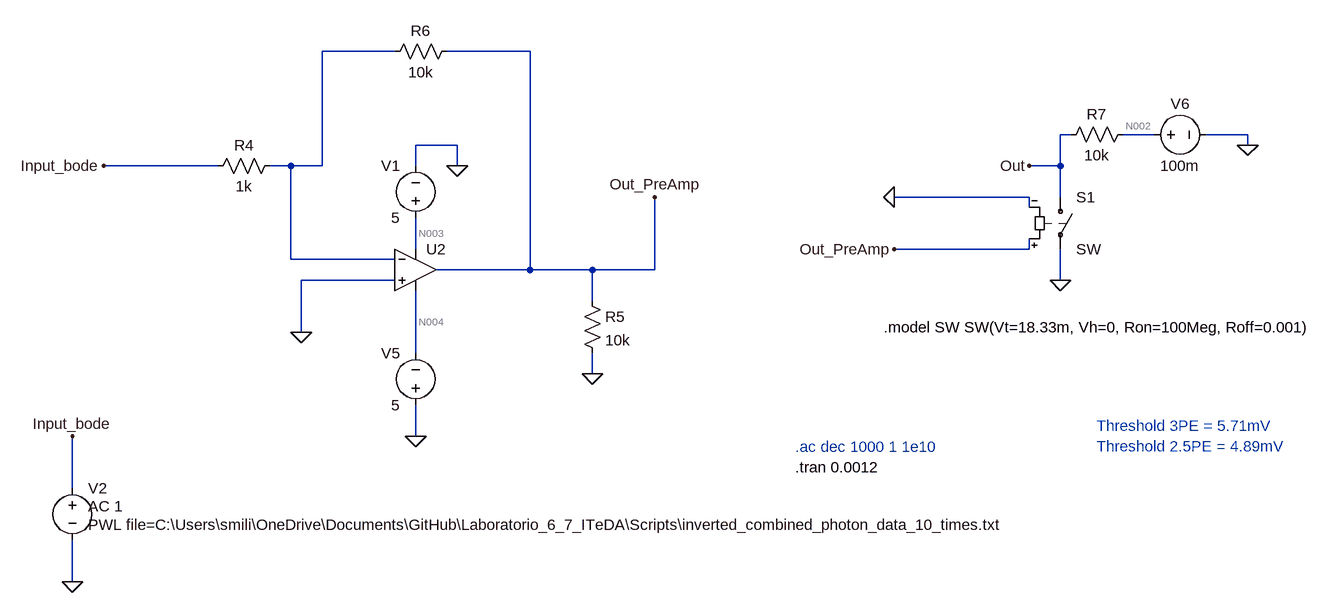
[diagram p0: schematic test_solo_preamp.asc]
test_solo_preamp.asc, the LTspice schematic file:
Version 4
SHEET 1 2516 1220
WIRE -768 -544 -880 -544
WIRE -560 -544 -688 -544
WIRE 272 -416 256 -416
WIRE 400 -416 352 -416
WIRE 544 -416 480 -416
WIRE -672 -400 -736 -400
WIRE 544 -400 544 -416
WIRE -1040 -368 -1216 -368
WIRE -928 -368 -960 -368
WIRE -880 -368 -880 -544
WIRE -880 -368 -928 -368
WIRE -736 -368 -736 -400
WIRE -672 -368 -672 -400
WIRE 256 -368 256 -416
WIRE 256 -368 208 -368
WIRE 208 -320 0 -320
WIRE 256 -320 256 -368
WIRE 208 -304 208 -320
WIRE -736 -240 -736 -288
WIRE 208 -240 208 -256
WIRE 208 -240 0 -240
WIRE -928 -224 -928 -368
WIRE -768 -224 -928 -224
WIRE -560 -208 -560 -544
WIRE -560 -208 -704 -208
WIRE -464 -208 -560 -208
WIRE -368 -208 -368 -320
WIRE -368 -208 -464 -208
WIRE -768 -192 -912 -192
WIRE 256 -192 256 -240
WIRE -464 -160 -464 -208
WIRE -912 -112 -912 -192
WIRE -736 -80 -736 -176
WIRE -464 -48 -464 -80
WIRE -736 48 -736 0
WIRE -1264 128 -1264 48
WIRE -1264 272 -1264 208
FLAG -1264 272 0
FLAG -1264 48 Input_bode
FLAG -736 48 0
FLAG -672 -368 0
FLAG -912 -112 0
FLAG -368 -320 Out_PreAmp
FLAG -1216 -368 Input_bode
FLAG -464 -48 0
FLAG 256 -192 0
FLAG 544 -400 0
FLAG 208 -368 Out
FLAG 0 -320 0
FLAG 0 -240 Out_PreAmp
SYMBOL res -944 -384 R90
WINDOW 0 0 56 VBottom 2
WINDOW 3 32 56 VTop 2
SYMATTR InstName R4
SYMATTR Value 1k
SYMBOL voltage -736 -272 R180
WINDOW 0 24 96 Left 2
WINDOW 3 24 16 Left 2
WINDOW 123 0 0 Left 0
WINDOW 39 0 0 Left 0
SYMATTR InstName V1
SYMATTR Value 5
SYMBOL voltage -736 16 R180
WINDOW 0 24 96 Left 2
WINDOW 3 24 16 Left 2
WINDOW 123 0 0 Left 0
WINDOW 39 0 0 Left 0
SYMATTR InstName V5
SYMATTR Value 5
SYMBOL OpAmps\\UniversalOpAmp1 -736 -208 R0
SYMATTR InstName U2
SYMATTR Value2 Avol=1Meg GBW=100Meg Vos=0
SYMBOL res -480 -176 R0
SYMATTR InstName R5
SYMATTR Value 10k
SYMBOL res -672 -560 R90
WINDOW 0 0 56 VBottom 2
WINDOW 3 32 56 VTop 2
SYMATTR InstName R6
SYMATTR Value 10k
SYMBOL voltage -1264 112 R0
WINDOW 123 24 44 Left 2
WINDOW 39 0 0 Left 0
WINDOW 3 24 72 Left 2
SYMATTR Value2 AC 1
SYMATTR Value PWL file=C:\Users\smili\OneDrive\Documents\GitHub\Laboratorio_6_7_ITeDA\Scripts\inverted_combined_photon_data_10_times.txt
SYMATTR InstName V2
SYMBOL sw 256 -336 R0
SYMATTR InstName S1
SYMBOL voltage 384 -416 R270
WINDOW 0 32 56 VTop 2
WINDOW 3 -32 56 VBottom 2
WINDOW 123 0 0 Left 0
WINDOW 39 0 0 Left 0
SYMATTR InstName V6
SYMATTR Value 100m
SYMBOL res 368 -432 R90
WINDOW 0 0 56 VBottom 2
WINDOW 3 32 56 VTop 2
SYMATTR InstName R7
SYMATTR Value 10k
TEXT -152 96 Left 2 !.tran 0.0012
TEXT -152 64 Left 2 ;.ac dec 1000 1 1e10
TEXT -16 -120 Left 2 !.model SW SW(Vt=18.33m, Vh=0, Ron=100Meg, Roff=0.001)
TEXT 312 32 Left 2 ;Threshold 3PE = 5.71mV\nThreshold 2.5PE = 4.89mV

The netlist it stands for:
* test_solo_preamp.asc
R4 N001 Input_bode 1k
V1 N003 0 5
V5 0 N004 5
XU2 0 N001 N003 N004 Out_PreAmp level1 Avol=1Meg GBW=100Meg Vos=0 En=0 Enk=0 In=0 Ink=0 Rin=500Meg  ; pins In+ In- V+ V- OUT
R5 Out_PreAmp 0 10k
R6 Out_PreAmp N001 10k
V2 Input_bode 0 PWL file=C:\Users\smili\OneDrive\Documents\GitHub\Laboratorio_6_7_ITeDA\Scripts\inverted_combined_photon_data_10_times.txt AC 1
S1 Out 0 Out_PreAmp 0 SW
V6 N002 0 100m
R7 N002 Out 10k
.tran 0.0012
* .ac dec 1000 1 1e10
.model SW SW(Vt=18.33m, Vh=0, Ron=100Meg, Roff=0.001)
* Threshold 3PE = 5.71mV
* Threshold 2.5PE = 4.89mV
.lib UniversalOpAmp1.lib
.backanno
.end

* Results of the author's LTspice run, read from the files saved beside the schematic
* Operating Point, zero values left out:
*   V(n003) = 5 V
*   V(n004) = -5 V
*   V(out) = 10 nV
*   V(n002) = 100 mV
*   I(R7) = 10 µA
*   I(S1) = -10 µA
*   I(V1) = -10 nA
*   I(V5) = -10 nA
*   I(V6) = -10 µA
*   Ix(u2:3) = 10 nA
*   Ix(u2:4) = -10 nA